# Altium schematic sheet interface2ad.SchDoc
size A4
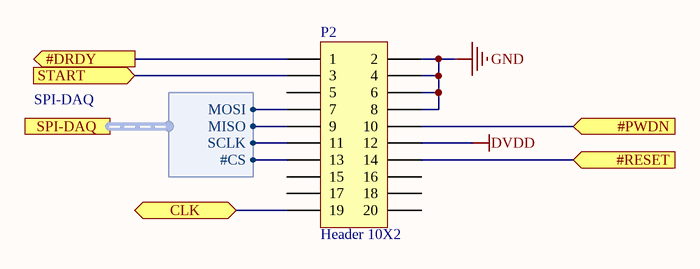
[diagram p0: interface2ad.SchDoc]

## Parts
P2  Header 10X2  [61002021121]

## Ports
#DRDY (out), #PWDN (in), #RESET (in), CLK (bidir), SPI-DAQ (harness SPI-DAQ), START (in)

## Harnesses
SPI-DAQ: #CS, MOSI, MISO, SCLK

## Nets
DVDD: P2.12
GND: P2.2 P2.4 P2.6 P2.8
#DRDY: P2.1 ; port #DRDY
#PWDN: P2.10 ; port #PWDN
#RESET: P2.14 ; port #RESET
CLK: P2.19 ; port CLK
START: P2.3 ; port START
NetP2_7: P2.7 ; port SPI-DAQ.MOSI
NetP2_9: P2.9 ; port SPI-DAQ.MISO
NetP2_11: P2.11 ; port SPI-DAQ.SCLK
NetP2_13: P2.13 ; port SPI-DAQ.#CS

Not connected (* = marked no-connect by the designer): P2 5 15 16 17 18 20

## Library data of the parts
P2 = Header 10X2: Header, 10-Pin, Dual row; LatestRevisionDate: 17-Jul-2002; LatestRevisionNote: Re-released for DXP Platform.; Publisher: Altium Limited